# EAGLE design ZATININHO V.1 (EAGLE 9.5.2)
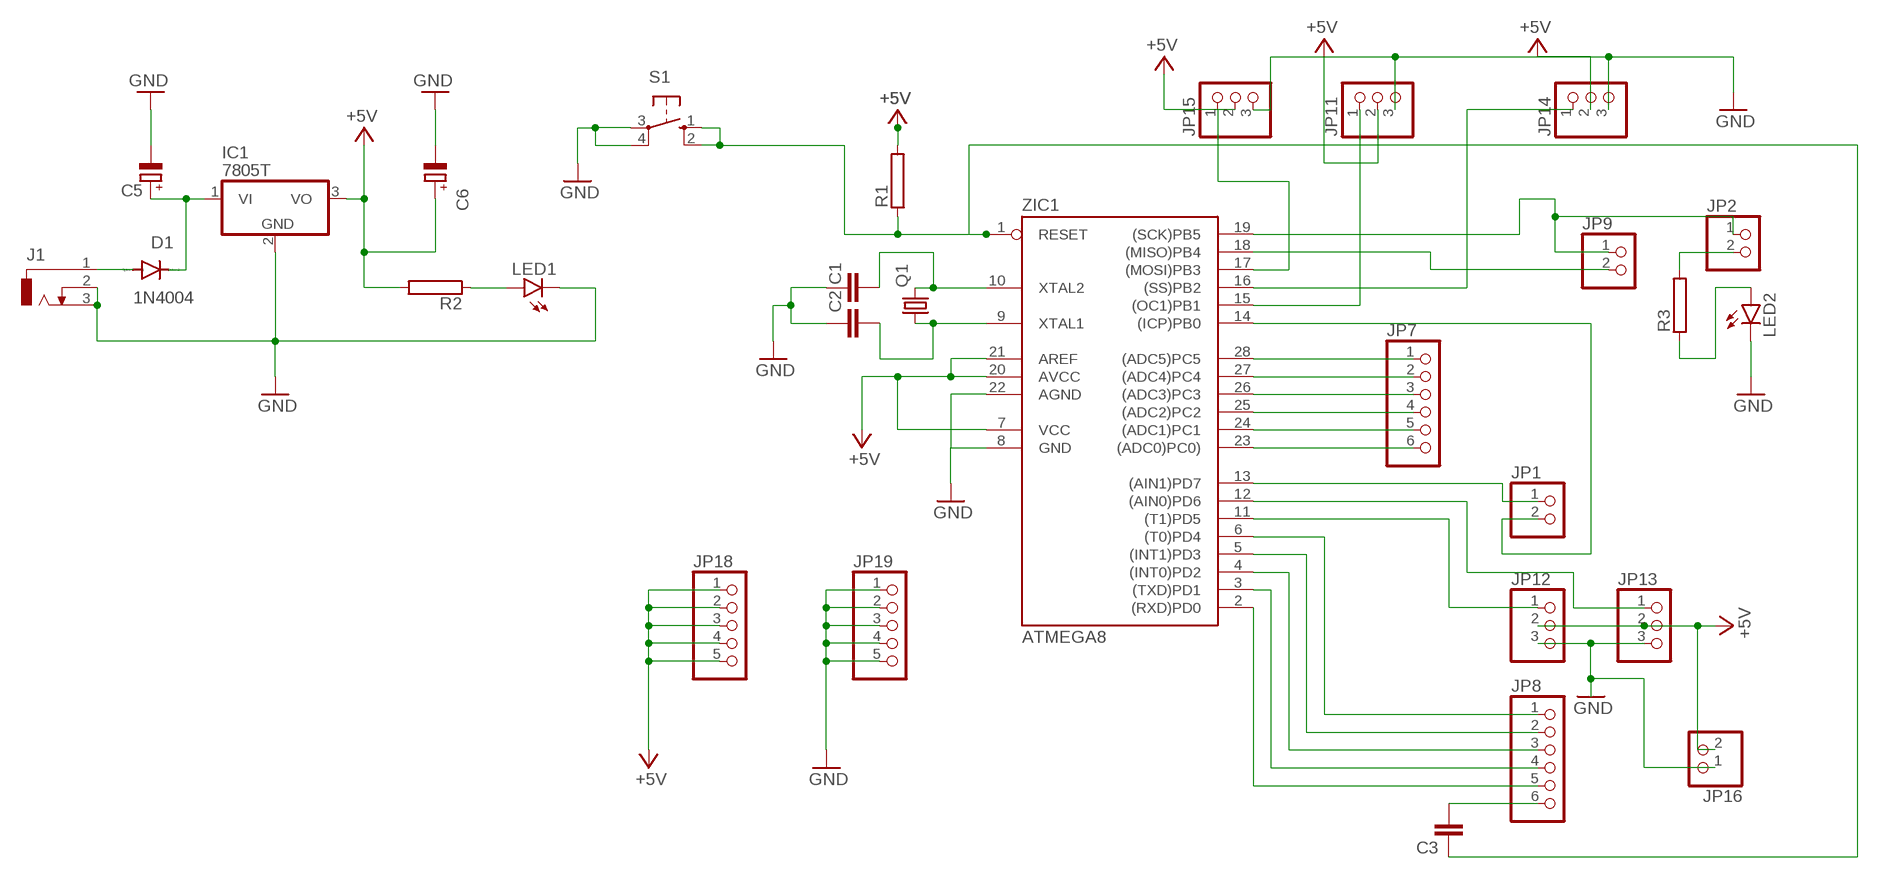
[diagram p0: schematic, sheet 1]

## Parts
C1  C2.5/2  [C2.5-2]
C2  C2.5/2  [C2.5-2]
C3  C2,5-3  [C2.5-3]
C5  CPOL-EUE2,5-6E  [E2,5-6E]
C6  CPOL-EUE2,5-6E  [E2,5-6E]
D1  1N4004  [DO41-10]
IC1  7805T  [TO220H]
J1  DCJ0303  [DCJ0303]
JP1  PINHD-1X2  [1X02]
JP2  PINHD-1X2  [1X02]
JP7  PINHD-1X6  [1X06]
JP8  PINHD-1X6  [1X06]
JP9  PINHD-1X2  [1X02]
JP11  PINHD-1X3  [1X03]
JP12  PINHD-1X3  [1X03]
JP13  PINHD-1X3  [1X03]
JP14  PINHD-1X3  [1X03]
JP15  PINHD-1X3  [1X03]
JP16  PINHD-1X2  [1X02]
JP18  PINHD-1X5  [1X05]
JP19  PINHD-1X5  [1X05]
LED1  LED5MM  [LED5MM]
LED2  LED5MM  [LED5MM]
Q1  CRYSTALHC49U-V  [HC49U-V]
R1  RRS1/4  [RS1/4]
R2  RRS1/4  [RS1/4]
R3  RRS1/4  [RS1/4]
S1  10-XX  [B3F-10XX]
ZIC1  ATMEGA8  AT90S4433P  [DIL28-3]

## Nets
+5V: C6.+ IC1.3(VO) JP11.2 JP12.2 JP13.2 JP14.2 JP15.2 JP16.2 JP18.1 JP18.2 JP18.3 JP18.4 JP18.5 R1.2 R2.2 ZIC1.7(VCC) ZIC1.20(AVCC) ZIC1.21(AREF)
GND: C1.1 C2.1 C5.- C6.- IC1.2(GND) J1.2 J1.3 JP11.3 JP12.3 JP13.3 JP14.3 JP15.3 JP16.1 JP19.1 JP19.2 JP19.3 JP19.4 JP19.5 LED1.K(C) LED2.K(C) S1.3(P) S1.4(P1) ZIC1.8(GND) ZIC1.22(AGND)
N$1: JP7.1 ZIC1.28((ADC5)PC5)
N$2: JP7.2 ZIC1.27((ADC4)PC4)
N$3: JP7.3 ZIC1.26((ADC3)PC3)
N$4: JP7.4 ZIC1.25((ADC2)PC2)
N$5: JP7.5 ZIC1.24((ADC1)PC1)
N$6: JP7.6 ZIC1.23((ADC0)PC0))
N$7: JP1.1 ZIC1.13((AIN1)PD7)
N$8: JP2.1 JP9.1 ZIC1.19((SCK)PB5)
N$9: JP12.1 ZIC1.11((T1)PD5)
N$10: C3.1 R1.1 S1.1(S) S1.2(S1) ZIC1.1(RESET)
N$11: JP9.2 ZIC1.18((MISO)PB4)
N$12: JP13.1 ZIC1.12((AIN0)PD6)
N$13: JP2.2 R3.2
N$14: JP15.1 ZIC1.17((MOSI)PB3)
N$15: JP14.1 ZIC1.16((SS)PB2)
N$16: JP11.1 ZIC1.15((OC1)PB1)
N$17: JP1.2 ZIC1.14((ICP)PB0)
N$18: JP8.5 ZIC1.2((RXD)PD0)
N$19: JP8.4 ZIC1.3((TXD)PD1)
N$20: JP8.3 ZIC1.4((INT0)PD2)
N$21: JP8.2 ZIC1.5((INT1)PD3)
N$22: JP8.1 ZIC1.6((T0)PD4)
N$23: LED2.A R3.1
N$24: C3.2 JP8.6
N$25: C2.2 Q1.1 ZIC1.9(XTAL1)
N$28: C1.2 Q1.2 ZIC1.10(XTAL2)
N$30: C5.+ D1.C IC1.1(VI)
N$32: LED1.A R2.1
N$33: D1.A J1.1

## Library data of the parts
C1-C3 = capacitor-wima:C: CAPACITOR naming: grid - package width
C5 C6 = rcl:CPOL-EU: POLARIZED CAPACITOR, European symbol; SPICEPREFIX: C
D1 = diode:1N4004: DIODE general purpose rectifier, 1 A
IC1 = linear:78*: Positive VOLTAGE REGULATOR Source: http://cache.national.com/ds/LM/LM78L05.pdf http://www.fairchildsemi.com/ds/LM/LM7805.pdf
J1 = con-jack:DCJ0303: DC POWER JACK Source: DCJ0303.pdf; OC_FARNELL: unknown; OC_NEWARK: unknown
JP1 JP2 JP9 JP16 = pinhead:PINHD-1X2: PIN HEADER
JP7 JP8 = pinhead:PINHD-1X6: PIN HEADER
JP11-JP15 = pinhead:PINHD-1X3: PIN HEADER
JP18 JP19 = pinhead:PINHD-1X5: PIN HEADER
LED1 LED2 = led:LED: LED OSRAM: - CHIPLED LG R971, LG N971, LY N971, LG Q971, LY Q971, LO R971, LY R971 LH N974, LH R974 LS Q976, LO Q976, LY Q976 LO Q996 - Hyper CHIPLED LW Q18S LB Q993, LB Q99A, LB R99A - SideLED LS A670, LO A670, LY A670, LG A670, LP A670 LB A673, LV A673, LT A673, LW A673 LH A674 LY A675 LS A676, LA A676, LO A676, LY A676, LW A676 LS A679, LY A679, LG A679 - Hyper Micro SIDELED® LS Y876, LA Y876, LO Y876, LY Y876 LT Y87S - SmartLED LW L88C, LW L88S LB L89C, LB L89S, LG L890 LS L89K, LO L89K, LY L89K LS L896, LA L896, LO L896, LY L896 - TOPLED LS T670, LO T670, LY T670, LG T670, LP T670 LSG T670, LSP T670, LSY T670, LOP T670, LYG T670 LG T671, LOG T671, LSG T671 LB T673, LV T673, LT T673, LW T673 LH T674 LS T676, LA T676, LO T676, LY T676, LB T676, LH T676, LSB T676, LW T676 LB T67C, LV T67C, LT T67C, LS T67K, LO T67K, LY T67K, LW E67C LS E67B, LA E67B, LO E67B, LY E67B, LB E67C, LV E67C, LT E67C LW T67C LS T679, LY T679, LG T679 LS T770, LO T770, LY T770, LG T770, LP T770 LB T773, LV T773, LT T773, LW T773 LH T774 LS E675, LA E675, LY E675, LS T675 LS T776, LA T776, LO T776, LY T776, LB T776 LHGB T686 LT T68C, LB T68C - Hyper Mini TOPLED® LB M676 - Mini TOPLED Santana® LG M470 LS M47K, LO M47K, LY M47K Source: http://www.osram.convergy.de LUXEON: - LUMILED® LXK2-PW12-R00, LXK2-PW12-S00, LXK2-PW14-U00, LXK2-PW14-V00 LXK2-PM12-R00, LXK2-PM12-S00, LXK2-PM14-U00 LXK2-PE12-Q00, LXK2-PE12-R00, LXK2-PE12-S00, LXK2-PE14-T00, LXK2-PE14-U00 LXK2-PB12-K00, LXK2-PB12-L00, LXK2-PB12-M00, LXK2-PB14-N00, LXK2-PB14-P00, LXK2-PB14-Q00 LXK2-PR12-L00, LXK2-PR12-M00, LXK2-PR14-Q00, LXK2-PR14-R00 LXK2-PD12-Q00, LXK2-PD12-R00, LXK2-PD12-S00 LXK2-PH12-R00, LXK2-PH12-S00 LXK2-PL12-P00, LXK2-PL12-Q00, LXK2-PL12-R00 Source: www.luxeon.com KINGBRIGHT: KA-3528ASYC Source: www.kingbright.com
Q1 = crystal:CRYSTAL: CRYSTAL; OC_FARNELL: 1666969; OC_NEWARK: unknown
R1-R3 = resistor-power:R: Power Resitor; MF: OHMITE; MPN: RRS1K0; OC_FARNELL: unknown; OC_NEWARK: 01F7661
S1 = switch-omron:10-XX: OMRON SWITCH; MPN: B3F-1000; OC_FARNELL: 176432; OC_NEWARK: 36M3542
ZIC1 = atmel:AT90S4433: MICROCONTROLLER 4 Kbytes FLASH 128 bytes SRAM 256 bytes EEPROM UART 6-channel 10 bit ADC

## Board
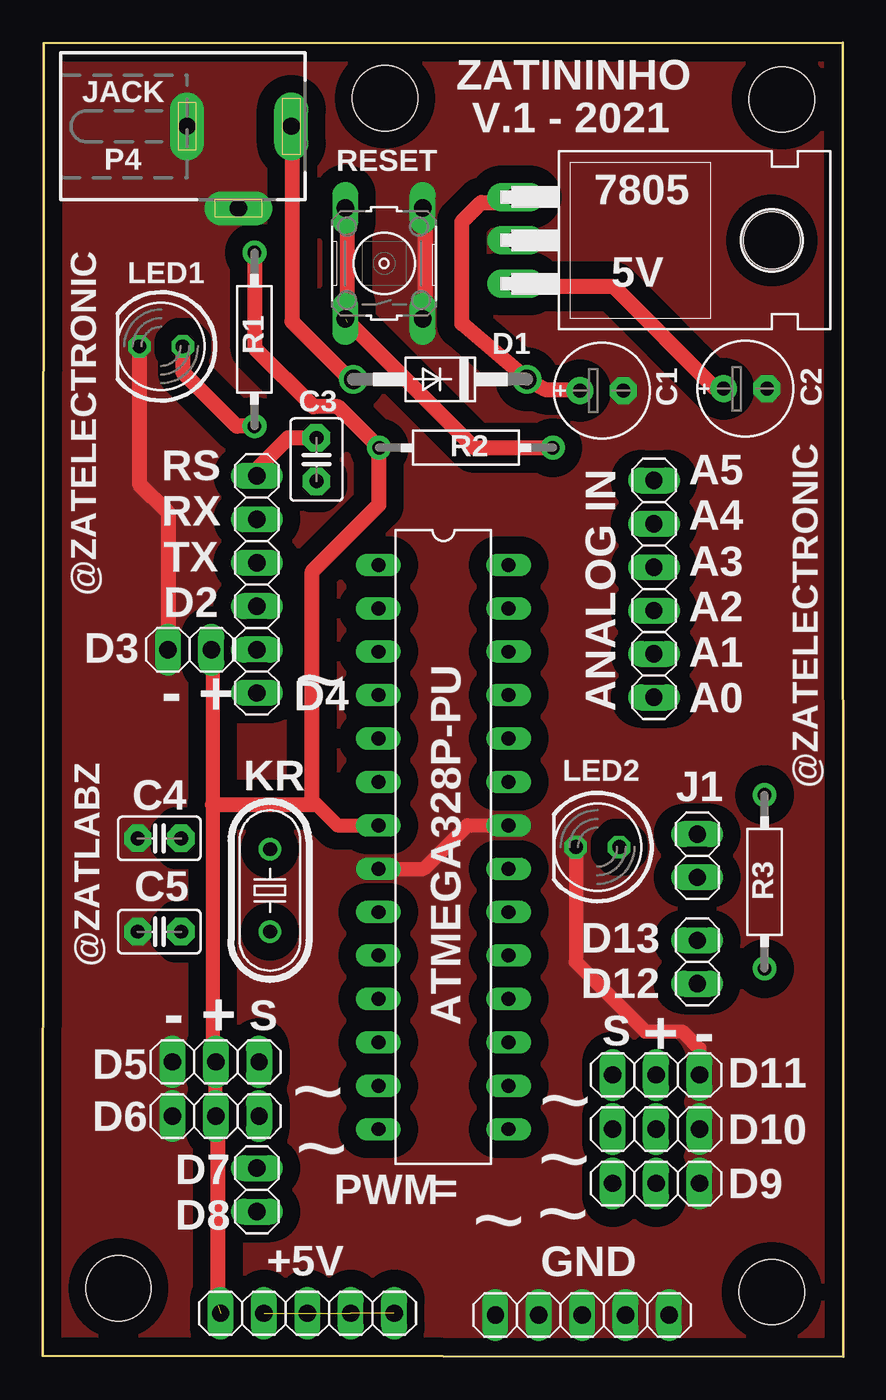
[diagram p1: board, top side]
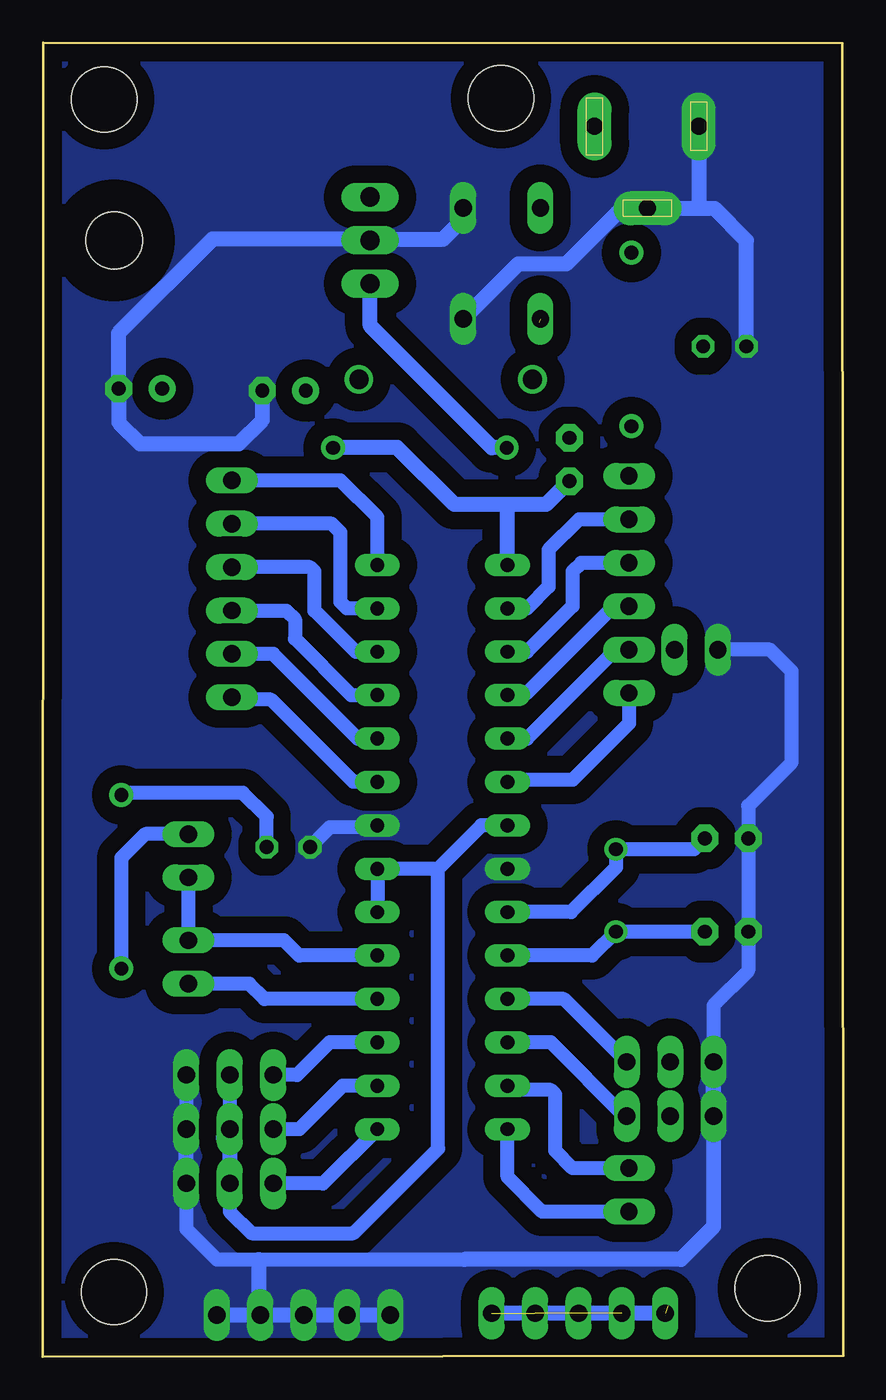
[diagram p2: board, bottom side, seen from below]

Size 46.86 x 76.91 mm. Coordinates in mm from the lower left corner, seen from the top.
Outline: 0.05,76.89 0,0.05 46.86,0 46.83,76.91 0.05,76.89
Copper layers (1*16): Top 0.035mm / dielectric 1.5mm / Bottom 0.035mm
Design rules "default *": minimum track width 35mil, minimum drill 0.35mm, track to track 6mil, track to pad 6mil, pad to pad 6mil, via to via 6mil, smd to smd 6mil, copper to edge 40mil, drill to drill 6mil, minimum pad ring 10mil, minimum via ring 8mil, stop-mask expansion 4mil, vias tented up to drill 0mil, thermal gap 10mil
Holes 3.81 mm at 4.43,4.01 42.69,3.79 43.27,73.59 20.04,73.66

### Footprints (pad centres in the part's own frame; a part is rotated, then mirrored left to right if it is on the bottom)
C2.5-2 = drill 0.813 pad 1.6 octagon: 1 -1.27,0; 2 1.27,0
C2.5-3 = drill 0.813 pad 1.6 octagon: 1 -1.27,0; 2 1.27,0
E2,5-6E = drill 0.813 pad 1.575: + -1.27,0 | drill 0.813 pad 1.575 octagon: - 1.27,0
DO41-10 = drill 1.118: A 5.08,0; C -5.08,0
TO220H = drill 1.118 long: 1 -2.54,-10.16; 2 0,-10.16; 3 2.54,-10.16 | hole 3.302: 0,4.826
DCJ0303 = drill 1 pad 2 long: 1 0,3.1; 2 4.8,0; 3 0,-3
1X02 = drill 1.016 long: 1 -1.27,0; 2 1.27,0
1X06 = drill 1.016 long: 1 -6.35,0; 2 -3.81,0; 3 -1.27,0; 4 1.27,0; 5 3.81,0; 6 6.35,0
1X03 = drill 1.016 long: 1 -2.54,0; 2 0,0; 3 2.54,0
1X05 = drill 1.016 long: 1 -5.08,0; 2 -2.54,0; 3 0,0; 4 2.54,0; 5 5.08,0
LED5MM = drill 0.813 octagon: A -1.27,0; K 1.27,0
HC49U-V = drill 0.813: 1 -2.413,0; 2 2.413,0
RS1/4 = drill 0.8 pad 1.4: 1 -5.08,0; 2 5.08,0
B3F-10XX = drill 1.016 long: 1 -3.251,2.261; 2 3.251,2.261; 3 -3.251,-2.261; 4 3.251,-2.261
DIL28-3 = drill 0.813 long: 1 -16.51,-3.81; 2 -13.97,-3.81; 3 -11.43,-3.81; 4 -8.89,-3.81; 5 -6.35,-3.81; 6 -3.81,-3.81; 7 -1.27,-3.81; 8 1.27,-3.81; 9 3.81,-3.81; 10 6.35,-3.81; 11 8.89,-3.81; 12 11.43,-3.81; 13 13.97,-3.81; 14 16.51,-3.81; 15 16.51,3.81; 16 13.97,3.81; 17 11.43,3.81; 18 8.89,3.81; 19 6.35,3.81; 20 3.81,3.81; 21 1.27,3.81; 22 -1.27,3.81; 23 -3.81,3.81; 24 -6.35,3.81; 25 -8.89,3.81; 26 -11.43,3.81; 27 -13.97,3.81; 28 -16.51,3.81

### Placement (x,y rotation side)
C1  6.83,24.88 0 top
C2  6.83,30.34 0 top
C3  16.03,52.51 90 top
C5  32.73,56.55 0 top
C6  41.13,56.66 0 top
D1  23.27,57.21 180 top
IC1  37.85,65.34 270 top
J1  11.45,72.02 270 top
JP1  12.54,9.77 270 top
JP2  38.32,29.33 90 top
JP7  35.78,44.95 270 top
JP8  12.54,45.2 90 top
JP9  38.32,23.1 270 top
JP11  35.91,10.15 0 top
JP12  10.13,17.26 180 top
JP13  10.13,14.09 180 top
JP14  35.91,13.32 0 top
JP15  35.91,16.5 0 top
JP16  8.6,41.39 0 top
JP18  15.49,2.55 0 top
JP19  31.58,2.44 0 top
LED1  6.93,59.14 180 top
LED2  32.48,29.83 180 top
Q1  13.3,27.29 270 top
R1  24.78,53.21 180 top
R2  12.39,59.54 90 top
R3  42.26,27.8 270 top
S1  19.99,63.99 90 top
ZIC1  23.46,29.83 270 top

### Tracks (layer width: path | path; a pad name or v marks a point on that pad's centre or on a via)
+5V  (4 unrouted)
  Top 0.152: 9.75,41.37 JP16.2
  Top 0.813: JP13.2 10.09,14.12 10.09,17.22 JP12.2 9.95,17.44 9.95,32.32 9.95,41.32 JP16.2 | 15.78,32.61 15.75,32.61 17.26,31.1 ZIC1.7
  Top 0.889: R2.2 12.44,64.61 12.44,59.02 15.85,55.6 17.3,55.6 R1.2 19.66,53.17 19.66,49.85 15.78,45.96 15.78,32.61 | IC1.3 27.88,62.62 33.43,62.62 39.39,56.66 C6.+ | 10.27,2.99 10.27,13.92 JP13.2 | 9.95,32.32 15.75,32.32 15.75,32.61
  Bottom 0.152: 10.03,17.36 JP12.2
  Bottom 0.813: ZIC1.7 21.18,31.1 23.72,28.56 | 23.72,28.56 ZIC1.21 ZIC1.20 | JP15.2 JP14.2 | JP14.2 35.91,13.07 36.29,12.69 36.29,12.94 JP14.2 | JP11.2 35.91,8.5 34.64,7.23 28.67,7.23 23.72,12.18 23.72,28.56
  Bottom 0.889: JP14.2 JP11.2 | R1.2 20.56,53.2 27.69,60.34 IC1.3 | JP18.1 JP18.5
GND
  Top 0.813: ZIC1.8 22.32,28.56 24.86,31.1 ZIC1.22 | LED2.K 31.21,23.1 35.27,19.04 37.43,19.04 38.45,18.02 JP15.3
  Top 0.889: S1.4 22.38,67.11 22.38,60.88 | JP19.4 34.28,2.28 | J1.2 10.27,67.22 | LED1.K 5.66,51.08 7.33,49.41 JP16.1
  Bottom 0.152: 27.27,31 ZIC1.22 | 5.66,24.88 C1.1 | 7.31,41.37 JP16.1 | 3.19,35.12 3.02,34.79
  Bottom 0.813: LED2.K 30.04,31 27.27,31 | JP15.3 JP14.3 | JP14.3 38.45,13.07 38.7,12.82 38.7,13.07 JP14.3 | JP11.3 38.45,7.48 36.67,5.7 34.22,5.7 22.19,5.7 22.07,5.7 | 5.66,24.88 5.56,24.98 C2.1 5.56,32.25 3.02,34.79 3.02,40.12 4.29,41.39 JP16.1 | C1.1 5.56,22.59 7.59,20.56 7.59,17.85 JP12.3 | 7.59,13.32 JP13.3
  Bottom 0.889: JP13.3 7.59,7.61 9.49,5.7 22.19,5.7 | JP12.3 JP13.3 | JP13.3 7.59,17.85 | JP11.3 JP14.3 | S1.4 22.25,66.59 23.44,65.4 27.59,65.4 IC1.2 27.77,65.41 36.92,65.41 42.43,59.9 42.43,56.69 C6.- 42.4,54.68 41.16,53.44 35.39,53.44 34,54.83 C5.- | 34.22,5.7 34.22,2.45 JP19.4 | LED1.K 5.66,65.34 7.54,67.22 8.31,67.22 | S1.3 19.02,63.97 16.21,63.97 12.89,67.29 11.53,67.29 J1.2 8.31,67.22 | J1.3 8.45,67.36 8.31,67.22 | JP19.1 JP19.5
  pour Bottom (isolate 1.016, no thermals): 0.6,76.82 46.83,76.82 46.83,0.09 -0.01,0.09 -0.01,76.85 0.93,76.85
  pour Top (isolate 1.016, no thermals): 0.22,76.87 46.98,76.87 46.98,0.27 0.12,0.27 0.12,76.85
N$1
  Bottom 0.152: 27.27,46.85 ZIC1.28
  Bottom 0.813: ZIC1.28 27.27,49.14 29.43,51.3 JP7.1
N$2
  Bottom 0.152: 35.53,48.25 JP7.2
  Bottom 0.813: ZIC1.27 29.05,43.8 29.43,44.18 29.43,48.25 29.94,48.76 JP7.2
N$3
  Bottom 0.152: 27.27,41.52 ZIC1.26 | 35.53,45.96 JP7.3
  Bottom 0.813: ZIC1.26 28.54,41.26 30.96,43.68 30.96,45.96 31.21,46.22 JP7.3
N$4
  Bottom 0.813: JP7.4 32.61,43.68 32.1,43.17 32.1,42.03 28.8,38.72 ZIC1.25
N$5
  Bottom 0.813: ZIC1.24 28.42,36.18 33.37,41.14 JP7.5
N$6
  Bottom 0.152: 27.27,33.9 ZIC1.23 | 35.53,38.34 35.65,38.47 JP7.6
  Bottom 0.813: ZIC1.23 28.67,33.64 33.5,38.47 35.65,38.47
N$7
  Bottom 0.152: 19.65,15.61 ZIC1.13
  Bottom 0.813: JP1.1 15.84,11.04 16.86,12.05 16.86,15.36 17.11,15.61 19.65,15.61
N$8
  Bottom 0.813: ZIC1.19 31.84,23.48 32.73,24.37 JP9.1 JP2.1
N$9
  Bottom 0.813: JP12.1 16.35,20.94 ZIC1.11
N$10  (1 unrouted)
  Top 0.889: 17.81,60.57 17.81,67.17 S1.2 | 17.89,60.91 S1.1 25.26,53.2 R1.1
  Bottom 0.889: R1.1 29.84,53.23 26.1,53.23 22.76,49.88 19.67,49.88 | C3.1 17.39,49.88 19.67,49.88 | ZIC1.1 19.65,49.86 19.67,49.88
N$11
  Bottom 0.813: ZIC1.18 33.88,20.94 34.77,21.83 JP9.2
N$12
  Bottom 0.152: 19.65,17.9 ZIC1.12 | 13.05,14.34 JP13.1
  Bottom 0.813: JP13.1 12.79,14.09 17.11,18.4 ZIC1.12
N$13
  Bottom 0.813: JP2.2 40.86,30.6 42.26,29.2 R3.2
N$14
  Bottom 0.152: 27.27,17.9 ZIC1.17
  Bottom 0.813: ZIC1.17 30.07,18.4 31.97,16.5 JP15.1
N$15
  Bottom 0.152: 27.27,15.61 ZIC1.16
  Bottom 0.813: ZIC1.16 29.3,15.86 31.84,13.32 JP14.1
N$16
  Bottom 0.813: ZIC1.15 30.45,10.15 JP11.1
N$17
  Bottom 0.813: JP1.2 17.62,8.5 19.65,10.53 ZIC1.14
N$18
  Bottom 0.813: JP8.5 15.46,49.01 17.24,47.23 17.24,45.07 18.51,43.8 ZIC1.2
N$19
  Bottom 0.152: 19.65,41.52 ZIC1.3 | 12.79,46.09 JP8.4
  Bottom 0.813: JP8.4 15.33,46.47 15.84,45.96 15.84,43.93 18.51,41.26 ZIC1.3
N$20
  Bottom 0.152: 19.65,39.23 19.65,38.85 ZIC1.4 | 12.79,43.8 JP8.3
  Bottom 0.813: JP8.3 13.43,43.93 18.51,38.85 19.65,38.85
N$21
  Bottom 0.152: 12.79,40.76 JP8.2
  Bottom 0.813: JP8.2 13.3,41.39 18.51,36.18 ZIC1.5
N$22
  Bottom 0.152: 19.65,33.9 19.65,33.77 ZIC1.6 | 12.79,38.47 JP8.1
  Bottom 0.813: JP8.1 12.54,37.07 15.84,33.77 19.65,33.77
N$23
  Bottom 0.813: LED2.A 33.75,31.61 35.15,33.01 42.13,33.01 R3.1
N$24
  Top 0.889: C3.2 14.36,53.78 12.54,51.96 JP8.6
N$25
  Bottom 0.152: 19.65,26.28 ZIC1.9
  Bottom 0.813: ZIC1.9 15.93,26.02 13.3,28.65 Q1.1 8.73,29.71 C2.2
N$28
  Bottom 0.152: 19.65,23.99 ZIC1.10
  Bottom 0.813: ZIC1.10 14.7,23.48 Q1.2 C1.2
N$30
  Top 0.889: C5.+ 31.46,56.62 29.41,56.62 D1.C 24.53,60.46 24.53,66.43 25.66,67.55 27.45,67.55 IC1.1
N$32
  Top 0.889: R2.1 11.36,54.46 8.2,57.62 LED1.A
N$33
  Top 0.889: D1.A 17.97,57.21 14.59,60.59 14.59,71 14.55,71.04 J1.1

### Text on the board
tNames: ZATININHO | JACK | V.1 - 2021 | P4 | RESET | 7805 | LED1 | 5V | R1 | D1 | C1 | C2 | C3 | @ZATELECTRONIC | R2 | RS / RX / TX / D2 | @ZATELECTRONIC | D3 | - | + | D4 | ~ | ANALOG IN | A5 / A4 / A3 / A2 / A1 / A0 | KR | LED2 | C4 | J1 | ATMEGA328P-PU | @ZATLABZ | C5 | R3 | D13 / D12 | - | + | S | S | + | - | D5 | D11 | ~ | D6 | ~ | D10 | D7 / D8 | ~ | ~ | PWM | = | D9 | ~ | ~ | +5V | GND